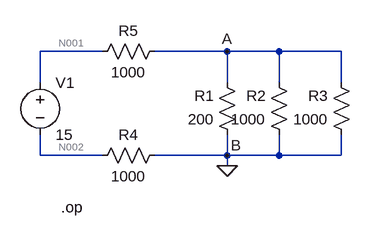
[diagram p0: schematic Draft1.asc]
Draft1.asc, the LTspice schematic file:
Version 4
SHEET 1 880 680
WIRE 48 16 -48 16
WIRE 240 16 128 16
WIRE 320 16 240 16
WIRE 416 16 320 16
WIRE -48 64 -48 16
WIRE 240 64 240 16
WIRE 320 64 320 16
WIRE 416 64 416 16
WIRE -48 176 -48 144
WIRE 48 176 -48 176
WIRE 240 176 240 144
WIRE 240 176 128 176
WIRE 320 176 320 144
WIRE 320 176 240 176
WIRE 416 176 416 144
WIRE 416 176 320 176
WIRE 240 192 240 176
FLAG 240 192 0
FLAG 240 16 A
FLAG 240 176 B
SYMBOL res 256 160 R180
WINDOW 0 36 76 Left 2
WINDOW 3 36 40 Left 2
SYMATTR InstName R1
SYMATTR Value 200
SYMBOL res 336 160 R180
WINDOW 0 36 76 Left 2
WINDOW 3 36 40 Left 2
SYMATTR InstName R2
SYMATTR Value 1000
SYMBOL res 432 160 R180
WINDOW 0 36 76 Left 2
WINDOW 3 36 40 Left 2
SYMATTR InstName R3
SYMATTR Value 1000
SYMBOL res 144 160 R90
WINDOW 0 0 56 VBottom 2
WINDOW 3 32 56 VTop 2
SYMATTR InstName R4
SYMATTR Value 1000
SYMBOL voltage -48 48 R0
SYMATTR InstName V1
SYMATTR Value 15
SYMBOL res 144 0 R90
WINDOW 0 0 56 VBottom 2
WINDOW 3 32 56 VTop 2
SYMATTR InstName R5
SYMATTR Value 1000
TEXT -16 256 Left 2 !.op

The netlist it stands for:
* Draft1.asc
R1 0 A 200
R2 0 A 1000
R3 0 A 1000
R4 0 N002 1000
V1 N001 N002 15
R5 A N001 1000
.op
.backanno
.end

* Results of the author's LTspice run, read from the files saved beside the schematic
* Operating Point:
*   V(a) = 1 V
*   V(n002) = -7 V
*   V(n001) = 8 V
*   I(R3) = -1 mA
*   I(R2) = -1 mA
*   I(R1) = -5 mA
*   I(R4) = 7 mA
*   I(R5) = -7 mA
*   I(V1) = -7 mA